# Altium schematic sheet A3.SchDoc: Название платы
size 420 x 297 mm; ApprovedBy: Рогов; CheckedBy: Фамилия проверяющего; DrawnBy: Фамилия разработчика; DocumentNumber: Введите номер платы + Э3; SheetNumber: пусто если лист 1, иначе 1; SheetTotal: количество листов; Title1str: (при необходимости вторая строка); DocumentType: тип схемы; Format: A3; ImagePath: Введите номер платы
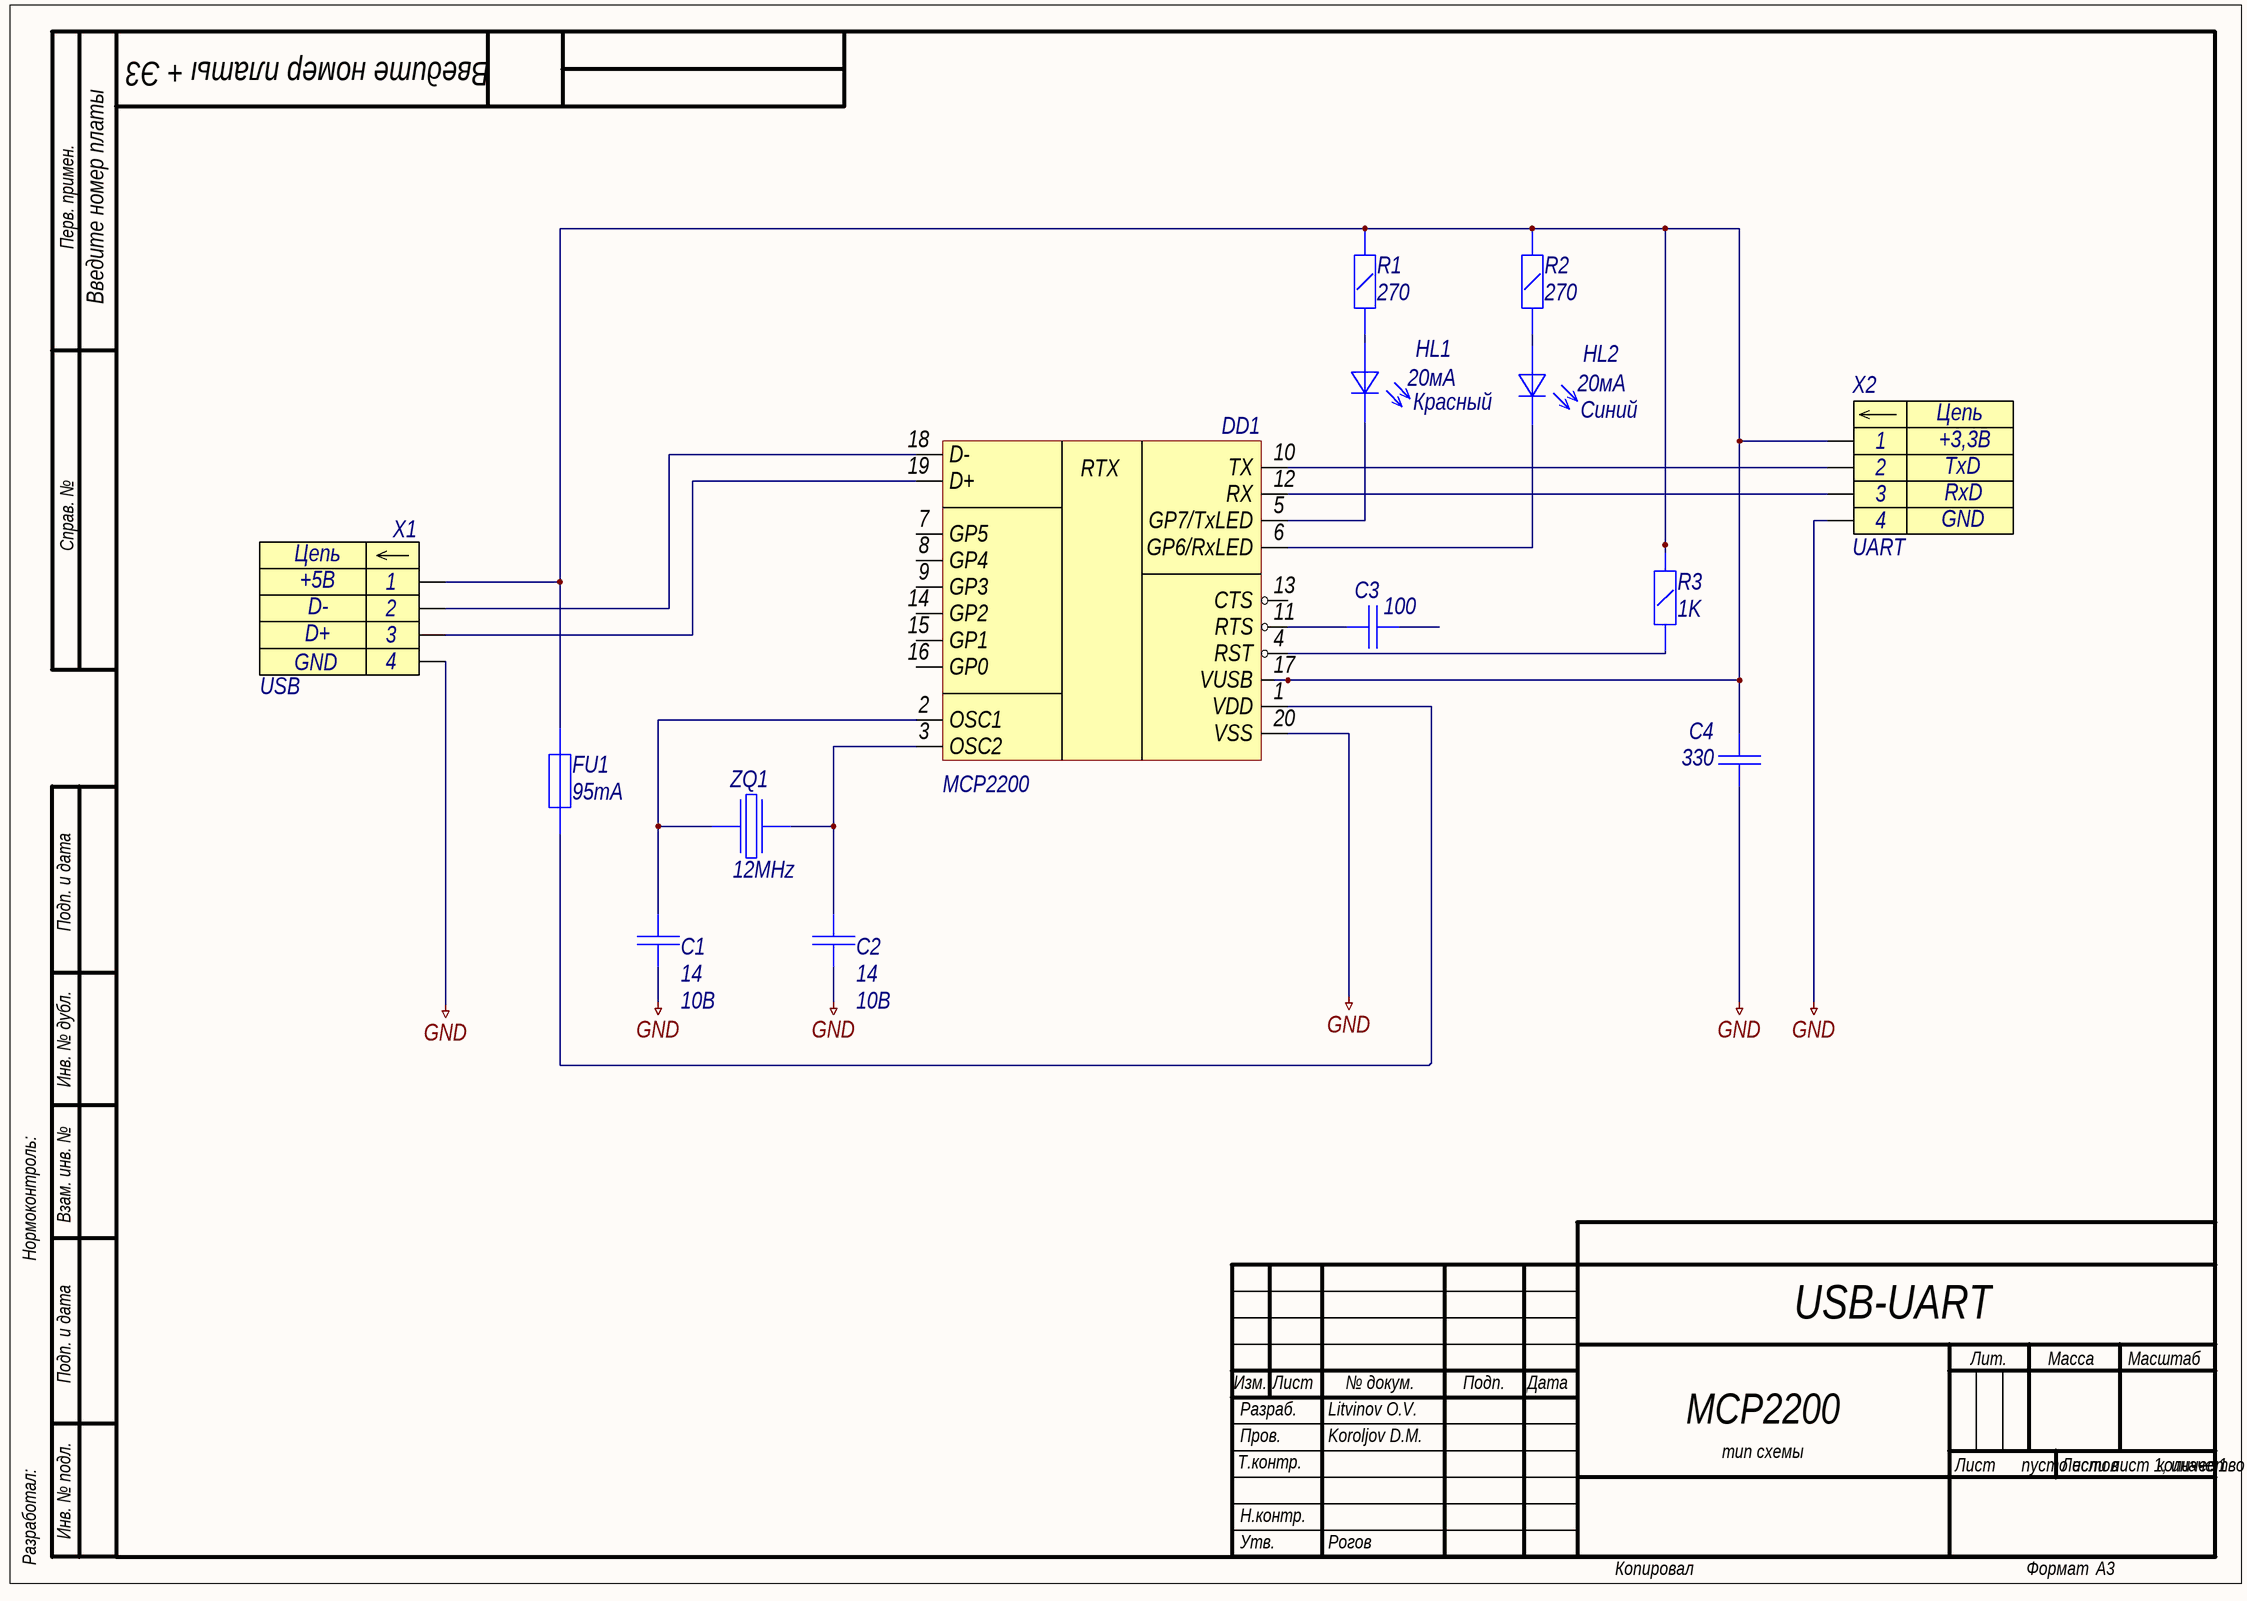
[diagram p0: A3.SchDoc]

## Parts
C1  value 14  Voltage: 10В  (hidden comment: Capacitor)
C2  value 14  Voltage: 10В  (hidden comment: Capacitor)
C3  value 100  [C0805]  (hidden comment: Capacitor)
C4  value 330  [C0805]  (hidden comment: Capacitor)
DD1  MCP2200  WTF: RTX  [SOP65P780X200-20N]
FU1  value 95mA  (hidden comment: Fuse)
HL1  Forward Current: 20мA  Color: Красный  [LD3528]  (hidden comment: Text)
HL2  Forward Current: 20мA  Color: Синий  [LD3528]  (hidden comment: Text)
R1  value 270  (hidden comment: Resistor_0,25W)
R2  value 270  (hidden comment: Resistor_0,25W)
R3  value 1K  (hidden comment: Resistor_0,25W)
X1  USB  U: +5В  Out: D-  In: D+  [USB]
X2  UART  In: TxD  Out: RxD  U: +3,3В  [UART]
ZQ1  Output Frequency: 12MHz  [KX9A]  (hidden comment: Crystal)

## Nets
GND: C1.1 C2.1 C4.1 DD1.20(VSS) X1.4 X2.4
NetC1_2: C1.2 DD1.2(OSC1) ZQ1.1
NetC2_2: C2.2 DD1.3(OSC2) ZQ1.3
NetC3_2: C3.2 DD1.11(RTS)
NetC4_2: C4.2 DD1.17(VUSB) FU1.2 R1.2 R2.2 R3.2 X1.1 X2.1
NetDD1_1: DD1.1(VDD) FU1.1
NetDD1_4: DD1.4(RST) R3.1
NetDD1_5: DD1.5(GP7/TxLED) HL1.2(К)
NetDD1_6: DD1.6(GP6/RxLED) HL2.2(К)
NetDD1_10: DD1.10(TX) X2.2
NetDD1_12: DD1.12(RX) X2.3
NetDD1_18: DD1.18(D-) X1.2
NetDD1_19: DD1.19(D+) X1.3
NetHL1_1: HL1.1(А) R1.1
NetHL2_1: HL2.1(А) R2.1

Not connected (* = marked no-connect by the designer): C3 1; DD1 7(GP5) 8(GP4) 9(GP3) 13(CTS) 14(GP2) 15(GP1) 16(GP0)

## Notes on the sheet
- Перв. примен.
- Справ. №
- Подп. и дата
- Инв. № дубл.
- Нормоконтроль:
- Взам. инв. №
- USB-UART
- Изм.
- Лист
- № докум.
- Подп.
- Дата
- Лит.
- Масса
- Масштаб
- Т.контр.
- Пров.
- Разраб.
- Koroljov D.M.
- Litvinov O.V.
- MCP2200
- Листов
- Разработал:
- Инв. № подл.
- Н.контр.
- Утв.
- Копировал
- Формат
- (in symbol UART) Цепь
- (in symbol USB) Цепь

## Library data of the parts
C1 C2 = Capacitor: Type: Конденсатор
C3 C4 = К10-69в-МП0-50В-2012М-1000пФ±5%: Manufacturer: ОАО "НИИ "Гириконд"; Type: Конденсатор; ID: 1; Voltage: 50V; Tolerance: ±5%; Dielectric Type: МП0; Specification: АЖЯР.673511.002 ТУ; Application Category: 5; Working Temperature Min: -60°С; Working Temperature Max: +125°С; Published: 18.05.2010; Publisher: Andrew Danich; Part Number: К10-69в-МП0-50В-2012М-1000пФ±5%; Footprint: 0805
DD1 = MCP2200: Create: Litvinov
HL1 = ИПД156А9-К: Manufacturer: ЗАО "Протон"; Type: Индикатор единичный; ID: 12; Forward Voltage: 3.3V; Luminous Flux: 130-450; Leds: 1; Specification: АЕЯР.432220.596 ТУ; Application Category: 5; Published: 03.12.2013; Publisher: Andrew Danich; Part Number: ИПД156А9-К; Value: ИПД156А9-К; Footprint: 3528
HL2 = ИПД156А9-С: Manufacturer: ЗАО "Протон"; Type: Индикатор единичный; ID: 15; Forward Voltage: 3.3V; Luminous Flux: 100-350; Leds: 1; Specification: АЕЯР.432220.596 ТУ; Application Category: 5; Published: 03.12.2013; Publisher: Andrew Danich; Part Number: ИПД156А9-С; Value: ИПД156А9-С; Footprint: 3528
X1 = USB: Create: Litvinov; GND: GND
X2 = UART: Create: Litvinov; GND: GND
ZQ1 = AB-12.000MALE-T: ID: 14; Load Capacitance: 12pF; Application Category: 1; Published: 08.03.2013; Publisher: Andrew Danich; Type: Резонатор; Part Number: AB-12.000MALE-T; Value: AB-12.000MALE-T
FU1 = Fuse: Type: Вставка плавкая
R1-R3 = Resistor_0,25W: Type: Резистор